# Altium schematic sheet Sheet1.SchDoc: BSPD
size A4; Author: TRR; Organization: Altium Limited; Address1: L3, 12a Rodborough Rd; Address2: Frenchs Forest; Address3: NSW; Address4: Australia 2086
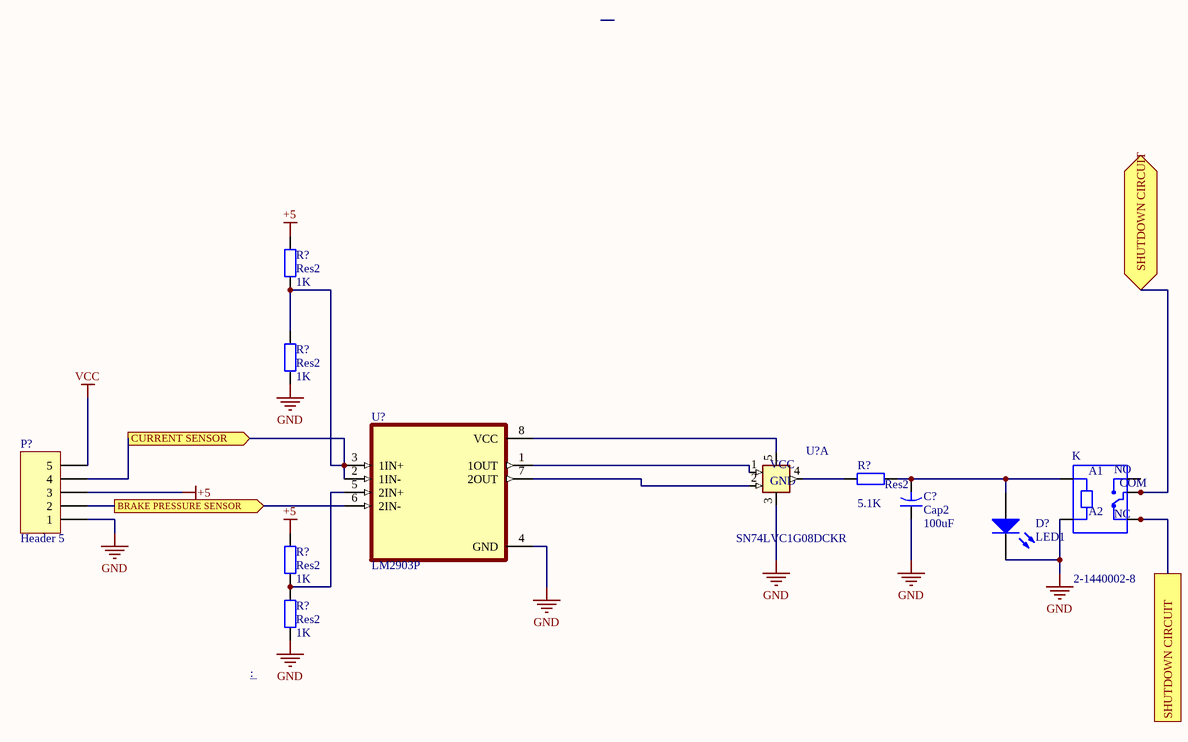
[diagram p0: Sheet1.SchDoc]

## Parts
(Parts that share a designator on the sheet are numbered #1, #2 ... from top to bottom, then left to right.)
C?  Cap2  value 100uF  [CAPR5-4X5]
D?  LED1  [LED-1]
K  2-1440002-8  [RELAY_2-1440002-8]
P?  Header 5  [HDR1X5]
R?#1  Res2  value 1K  [AXIAL-0.4]
R?#2  Res2  value 1K  [AXIAL-0.4]
R?#3  Res2  value 5.1K  [AXIAL-0.4]
R?#4  Res2  value 1K  [AXIAL-0.4]
R?#5  Res2  value 1K  [AXIAL-0.4]
U?#1  SN74LVC1G08DCKR  [SOT65P210X110-5N]  (part A of 2)
U?#2  LM2903P  [DIP794W45P254L959H508Q8]

## Ports
BRAKE PRESSURE SENSOR (out), CURRENT SENSOR (out), SHUTDOWN CIRCUIT, SHUTDOWN CIRCUIT (bidir)

## Nets
+5: P?.3 R?#1.2 R?#4.2
GND: C?.1 D?.2(K) K.A2 P?.1 R?#2.1 R?#5.1 U?#1.3(GND) U?#2.4(GND)
VCC: P?.5
BRAKE PRESSURE SENSOR: P?.2 U?#2.6(2IN-) ; port BRAKE PRESSURE SENSOR
CURRENT SENSOR: P?.4 R?#1.1 R?#2.2 U?#2.2(1IN-) U?#2.3(1IN+) ; port CURRENT SENSOR
SHUTDOWN CIRCUIT: K.COM_1(COM) K.COM_2(COM) K.NC_1(NC) K.NC_2(NC) ; port SHUTDOWN CIRCUIT
NetC?_2: C?.2 D?.1(A) K.A1 R?#3.2
NetK_NO_1: K.NO_1(NO) K.NO_2(NO)
NetR?#3_1: R?#3.1 U?#1.4(C)
NetR?#4_1: R?#4.1 R?#5.2 U?#2.5(2IN+)
NetU?#1_1: U?#1.1(A) U?#2.1(1OUT)
NetU?#1_2: U?#1.2(B) U?#2.7(2OUT)
NetU?#1_5: U?#1.5(VCC) U?#2.8(VCC)

## Notes on the sheet
- Title
- Size:
- Date:
- A4
- Number:
- Time:
- Revision:
- Sheet
- of
- File:

## Library data of the parts
C? = Cap2: Capacitor; Published: 23-Sep-2002; PackageReference: CAPR5-4X5; Publisher: Altium Limited; PackageDescription: Capacitor; 2 Leads
D? = LED1: Typical RED GaAs LED; Published: 8-Jun-2000; LatestRevisionDate: 08-Jul-2005; LatestRevisionNote: Mech Layer 1 removed.; PackageReference: LED-1; Publisher: Altium Limited; PackageDescription: LED; 2 Leads
K = 2-1440002-8: General Purpose Relay, OZ Series, Power, Non Latching, SPDT, 24 VDC, 16 A; MF: TE Connectivity; Availability: Unavailable; Value: *; Package: None; Price: None; SnapEDA_Link: https://www.snapeda.com/parts/2-1440002-8/TE%20Connectivity%20Potter%20&%20Brumfield%20Relays/view-part/2622155/?ref=snap; MP: 2-1440002-8
P? = Header 5: Header, 5-Pin; LatestRevisionDate: 17-Jul-2002; LatestRevisionNote: Re-released for DXP Platform.; Publisher: Altium Limited
R?#1-R?#5 = Res2: Resistor; Published: 8-Jun-2000; LatestRevisionDate: 17-Jul-2002; LatestRevisionNote: Re-released for DXP Platform.; PackageReference: AXIAL-0.4; Publisher: Altium Limited; PackageDescription: Axial Device, Thru-Hole; 2 Leads; 0.4 in Pin Spacing
U?#1 = SN74LVC1G08DCKR: Single 2-Input Positive-AND Gate 5-SC70 -40 to 125; MF: Texas Instruments; Availability: Good; Package: SOT-SC70-5 Texas Instruments; Value: *; Price: None; SnapEDA_Link: https://www.snapeda.com/parts/SN74LVC1G08DCKR/Texas%20Instruments/view-part/78672/?ref=snap; Check_prices: https://www.snapeda.com/parts/SN74LVC1G08DCKR/Texas%20Instruments/view-part/78672/?ref=eda; Purchase-URL: https://pricing.snapeda.com/search/part/SN74LVC1G08DCKR/?ref=eda; MP: SN74LVC1G08DCKR
U?#2 = LM2903P: Dual differential comparator, automotive grade 8-PDIP -40 to 125; MF: Texas Instruments; SnapEDA_Link: https://www.snapeda.com/parts/LM2903P/Texas%20Instruments/view-part/503784/?ref=snap; Value: *; MP: LM2903P; Availability: Warning; Check_prices: https://www.snapeda.com/parts/LM2903P/Texas%20Instruments/view-part/503784/?ref=eda; Package: PDIP-8 Texas; Purchase-URL: https://pricing.snapeda.com/search/part/LM2903P/?ref=eda; Price: None